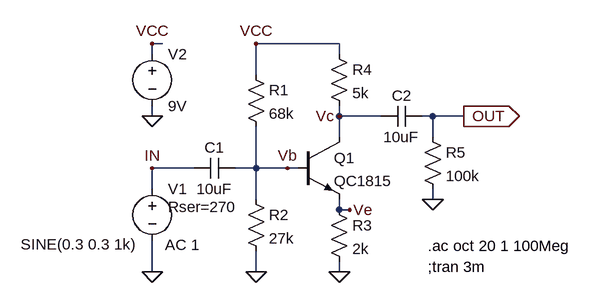
[diagram p0: schematic EmitterCommon_QC1815.asc]
EmitterCommon_QC1815.asc, the LTspice schematic file:
Version 4
SHEET 1 880 680
WIRE 16 -16 0 -16
WIRE 288 -16 160 -16
WIRE 0 0 0 -16
WIRE 288 0 288 -16
WIRE 160 32 160 -16
WIRE 0 96 0 80
WIRE 288 96 288 80
WIRE 352 96 288 96
WIRE 432 96 416 96
WIRE 480 96 432 96
WIRE 288 128 288 96
WIRE 432 128 432 96
WIRE 64 176 0 176
WIRE 160 176 160 112
WIRE 160 176 128 176
WIRE 208 176 160 176
WIRE 224 176 208 176
WIRE 0 208 0 176
WIRE 160 224 160 176
WIRE 432 224 432 208
WIRE 288 240 288 224
WIRE 304 240 288 240
WIRE 0 336 0 288
WIRE 160 336 160 304
WIRE 288 336 288 320
FLAG 0 336 0
FLAG 160 336 0
FLAG 288 336 0
FLAG 480 96 OUT
IOPIN 480 96 Out
FLAG 160 -16 VCC
FLAG 0 96 0
FLAG 0 -16 VCC
FLAG 0 176 IN
FLAG 208 176 Vb
FLAG 304 240 Ve
FLAG 288 96 Vc
FLAG 432 224 0
SYMBOL npn 224 128 R0
SYMATTR InstName Q1
SYMATTR Value QC1815
SYMBOL cap 128 160 R90
WINDOW 0 0 32 VBottom 2
WINDOW 3 32 32 VTop 2
SYMATTR InstName C1
SYMATTR Value 10uF
SYMBOL res 144 16 R0
SYMATTR InstName R1
SYMATTR Value 68k
SYMBOL res 144 208 R0
SYMATTR InstName R2
SYMATTR Value 27k
SYMBOL voltage 0 192 R0
WINDOW 3 -24 101 Right 2
WINDOW 123 20 102 Left 2
WINDOW 39 24 44 Left 2
SYMATTR Value SINE(0.3 0.3 1k)
SYMATTR Value2 AC 1
SYMATTR SpiceLine Rser=270
SYMATTR InstName V1
SYMBOL res 272 224 R0
SYMATTR InstName R3
SYMATTR Value 2k
SYMBOL res 272 -16 R0
SYMATTR InstName R4
SYMATTR Value 5k
SYMBOL voltage 0 -16 R0
WINDOW 123 0 0 Left 2
WINDOW 39 0 0 Left 2
SYMATTR InstName V2
SYMATTR Value 9V
SYMBOL cap 416 80 R90
WINDOW 0 0 32 VBottom 2
WINDOW 3 32 32 VTop 2
SYMATTR InstName C2
SYMATTR Value 10uF
SYMBOL res 416 112 R0
SYMATTR InstName R5
SYMATTR Value 100k
TEXT 424 328 Left 2 !;tran 3m
TEXT 424 296 Left 2 !.ac oct 20 1 100Meg

The netlist it stands for:
* EmitterCommon_QC1815.asc
Q1 Vc Vb Ve 0 QC1815
C1 Vb IN 10uF
R1 VCC Vb 68k
R2 Vb 0 27k
V1 IN 0 SINE(0.3 0.3 1k) AC 1 Rser=270
R3 Ve 0 2k
R4 VCC Vc 5k
V2 VCC 0 9V
C2 OUT Vc 10uF
R5 OUT 0 100k
.model NPN NPN
.model PNP PNP
.lib standard.bjt
;tran 3m
.ac oct 20 1 100Meg
.backanno
.end